# EAGLE design mMicroSD (EAGLE 6.2)
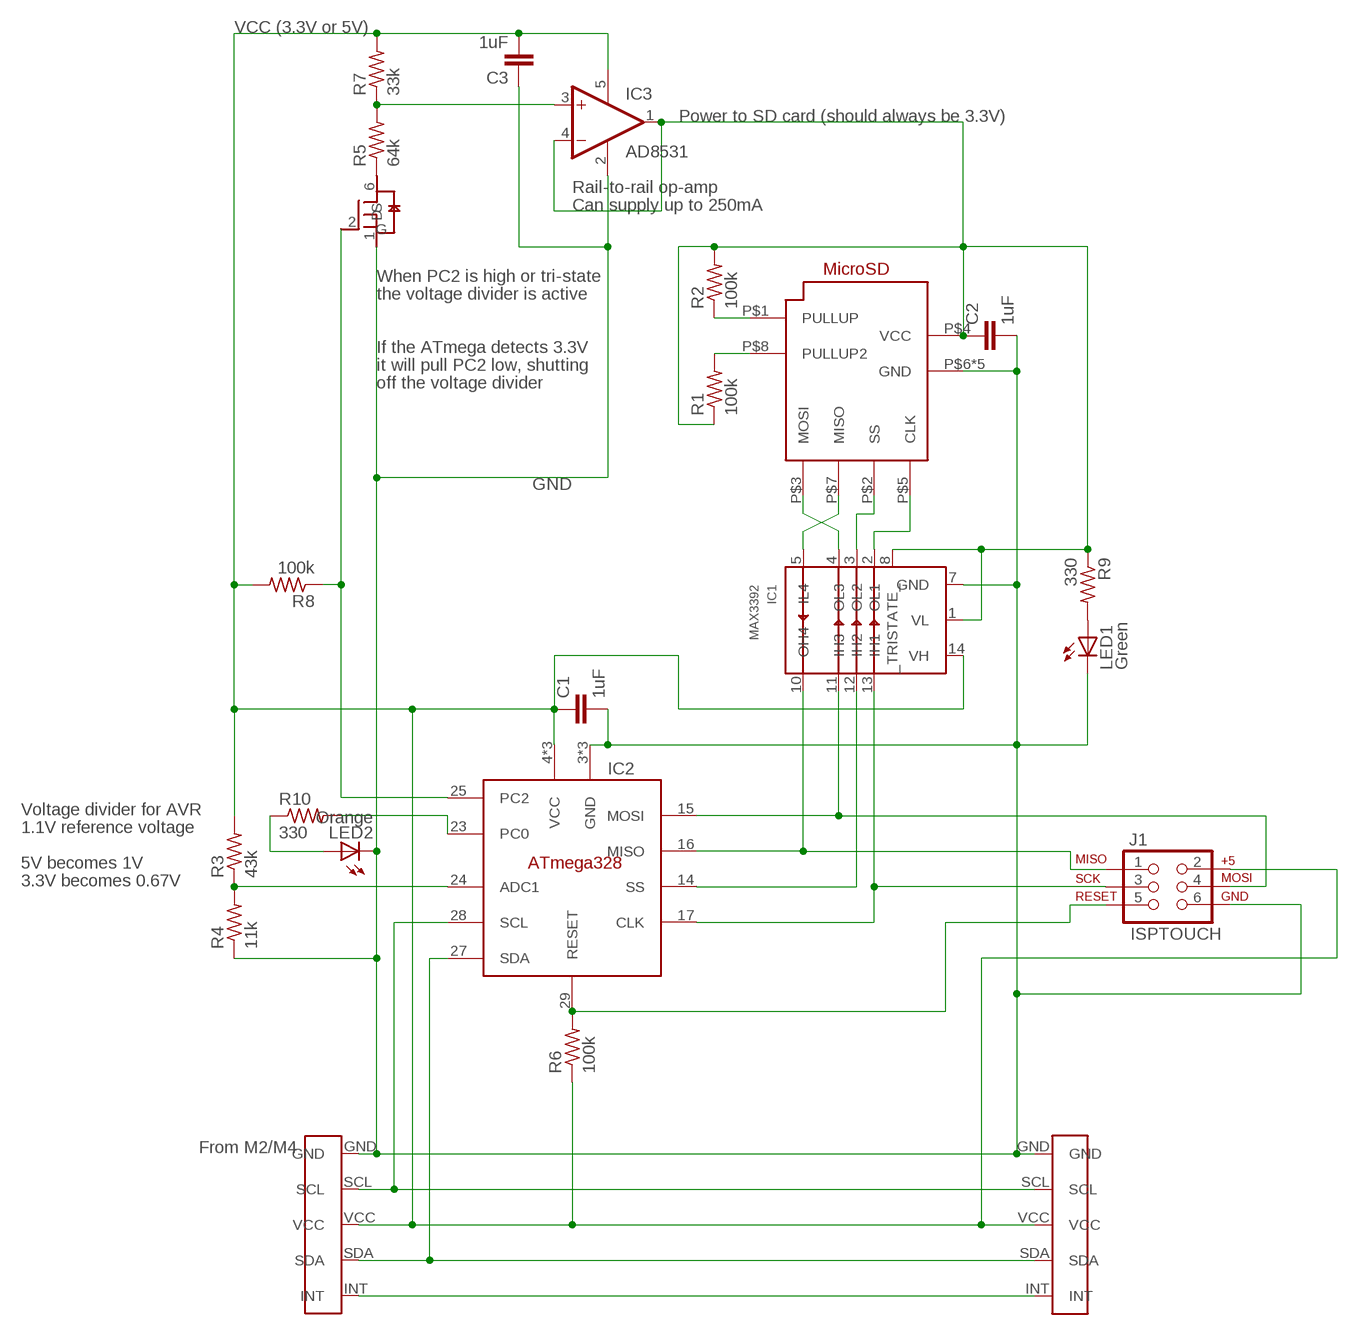
[diagram p0: schematic, sheet 1]

## Parts
C1  1uF  C-EUC0603  [C0603]
C2  1uF  C-EUC0603  [C0603]
C3  1uF  C-EUC0603  [C0603]
IC1  MAX3392  [14-TSSOP]
IC2  ATMEGA328  [ATMEGA328]
IC3  AD8531  [SOT-23-5]
J1  ISPTOUCH  ISPTOUCH_ADAPTER  [AVX_9188_6-WAY_SMT]
LED1  Green  LEDSML0603  [SML0603]
LED2  Orange  LEDSML0603  [SML0603]
M1  NTJD5121N  NTJD5121NT1G  [SOT-363]
R1  100k  R-US_R0603  [R0603]
R2  100k  R-US_R0603  [R0603]
R3  43k  R-US_R0603  [R0603]
R4  11k  R-US_R0603  [R0603]
R5  64k  R-US_R0603  [R0603]
R6  100k  R-US_R0603  [R0603]
R7  33k  R-US_R0603  [R0603]
R8  100k  R-US_R0603  [R0603]
R9  330  R-US_R0603  [R0603]
R10  330  R-US_R0603  [R0603]
SDCONN  101-00660-68-6  [101-00660-68-6]
U$1  MBUS_OUT  [MBUS_OUT]
U$2  MBUS_IN  [MBUS_IN]

## Nets
GND: C1.2 C2.2 C3.1 IC1.7(GND) IC2.3(GND) IC2.5(GND) IC2.21(GND) IC3.2(V-) J1.6 LED1.C LED2.C M1.1(S) R4.1 SDCONN.P$6(GND) SDCONN.P$9(GND) SDCONN.P$10(GND) SDCONN.P$11(GND) SDCONN.P$12(GND) U$1.GND U$2.GND
INT: U$1.INT U$2.INT
MISO: IC1.10(OH4) IC2.16(MISO) J1.1
MOSI: IC1.11(IH3) IC2.15(MOSI) J1.4
N$1: M1.6(D) R5.1
N$2: LED1.A R9.2
N$3: IC2.23(PC0) R10.2
N$4: LED2.A R10.1
N$5: IC1.5(IL4) SDCONN.P$7(MISO)
N$6: IC1.4(OL3) SDCONN.P$3(MOSI)
N$10: IC2.25(PC2) M1.2(G) R8.1
N$11: IC1.3(OL2) SDCONN.P$2(SS)
N$12: R1.2 SDCONN.P$8(PULLUP2)
N$13: R2.1 SDCONN.P$1(PULLUP)
N$15: IC1.2(OL1) SDCONN.P$5(CLK)
N$17: IC2.24(ADC1) R3.1 R4.2
OPAMP_VOLTAGE: IC3.3(+IN) R5.2 R7.1
RESET: IC2.29(RESET) J1.5 R6.2
SCK: IC1.13(IH1) IC2.17(CLK) J1.3
SCL: IC2.28(SCL) U$1.SCL U$2.SCL
SDA: IC2.27(SDA) U$1.SDA U$2.SDA
SS: IC1.12(IH2) IC2.14(SS)
VCC_MBUS: C1.1 C3.2 IC1.14(VH) IC2.4(VCC) IC2.6(VCC) IC2.18(VCC) IC3.5(V+) J1.2 R3.2 R6.1 R7.2 R8.2 U$1.VCC U$2.VCC
VCC_SD: C2.1 IC1.1(VL) IC1.8(_TRISTATE_) IC3.1(OUT) IC3.4(-IN) R1.1 R2.2 R9.1 SDCONN.P$4(VCC)
Unconnected: M1.3(D) M1.4(S) M1.5(G)

## Notes on the sheet
- VCC (3.3V or 5V)
- Power to SD card (should always be 3.3V)
- Rail-to-rail op-amp
- Can supply up to 250mA
- When PC2 is high or tri-state
- the voltage divider is active
- If the ATmega detects 3.3V
- it will pull PC2 low, shutting
- off the voltage divider
- Voltage divider for AVR
- 1.1V reference voltage
- 5V becomes 1V
- 3.3V becomes 0.67V
- From M2/M4

## Library data of the parts
C1-C3 = resistor:C-EU: CAPACITOR, European symbol
IC1 = haptics:MAX3392: 16Mbps level translator 3 high-to-low 1 low-to-high Min 1.2V Max 5.5V
IC2 = zz-kent:ATMEGA328
IC3 = haptics:AD8531: Rail-to-rail op amp, 2.7V to 6V supply difference, 250mA output
J1 = daspilker_ISPtouch:ISPTOUCH: ISPtouch for AVR Microcontrollers This 6-pin ISP connector for AVR programming does not require any part on the PCB, but an adapter for a common 6-pin programmer. http://daniel-spilker.com/blog/2011/04/25/isptouch-for-avr-microcontrollers/
LED1 LED2 = led:LED: LED OSRAM: - CHIPLED LG R971, LG N971, LY N971, LG Q971, LY Q971, LO R971, LY R971 LH N974, LH R974 LS Q976, LO Q976, LY Q976 LO Q996 - Hyper CHIPLED LW Q18S LB Q993, LB Q99A, LB R99A - SideLED LS A670, LO A670, LY A670, LG A670, LP A670 LB A673, LV A673, LT A673, LW A673 LH A674 LY A675 LS A676, LA A676, LO A676, LY A676, LW A676 LS A679, LY A679, LG A679 - Hyper Micro SIDELED® LS Y876, LA Y876, LO Y876, LY Y876 LT Y87S - SmartLED LW L88C, LW L88S LB L89C, LB L89S, LG L890 LS L89K, LO L89K, LY L89K LS L896, LA L896, LO L896, LY L896 - TOPLED LS T670, LO T670, LY T670, LG T670, LP T670 LSG T670, LSP T670, LSY T670, LOP T670, LYG T670 LG T671, LOG T671, LSG T671 LB T673, LV T673, LT T673, LW T673 LH T674 LS T676, LA T676, LO T676, LY T676, LB T676, LH T676, LSB T676, LW T676 LB T67C, LV T67C, LT T67C, LS T67K, LO T67K, LY T67K, LW E67C LS E67B, LA E67B, LO E67B, LY E67B, LB E67C, LV E67C, LT E67C LW T67C LS T679, LY T679, LG T679 LS T770, LO T770, LY T770, LG T770, LP T770 LB T773, LV T773, LT T773, LW T773 LH T774 LS E675, LA E675, LY E675, LS T675 LS T776, LA T776, LO T776, LY T776, LB T776 LHGB T686 LT T68C, LB T68C - Hyper Mini TOPLED® LB M676 - Mini TOPLED Santana® LG M470 LS M47K, LO M47K, LY M47K Source: http://www.osram.convergy.de LUXEON: - LUMILED® LXK2-PW12-R00, LXK2-PW12-S00, LXK2-PW14-U00, LXK2-PW14-V00 LXK2-PM12-R00, LXK2-PM12-S00, LXK2-PM14-U00 LXK2-PE12-Q00, LXK2-PE12-R00, LXK2-PE12-S00, LXK2-PE14-T00, LXK2-PE14-U00 LXK2-PB12-K00, LXK2-PB12-L00, LXK2-PB12-M00, LXK2-PB14-N00, LXK2-PB14-P00, LXK2-PB14-Q00 LXK2-PR12-L00, LXK2-PR12-M00, LXK2-PR14-Q00, LXK2-PR14-R00 LXK2-PD12-Q00, LXK2-PD12-R00, LXK2-PD12-S00 LXK2-PH12-R00, LXK2-PH12-S00 LXK2-PL12-P00, LXK2-PL12-Q00, LXK2-PL12-R00 Source: www.luxeon.com KINGBRIGHT: KA-3528ASYC Source: www.kingbright.com
M1 = haptics:NTJD5121NT1G: Dual 60V N-channel MOSFETs
R1-R10 = resistor:R-US_: RESISTOR, American symbol
SDCONN = zz-kent:101-00660-68-6: MicroSD connector
U$1 = zz-kent:MBUS_OUT
U$2 = zz-kent:MBUS_IN

## Board
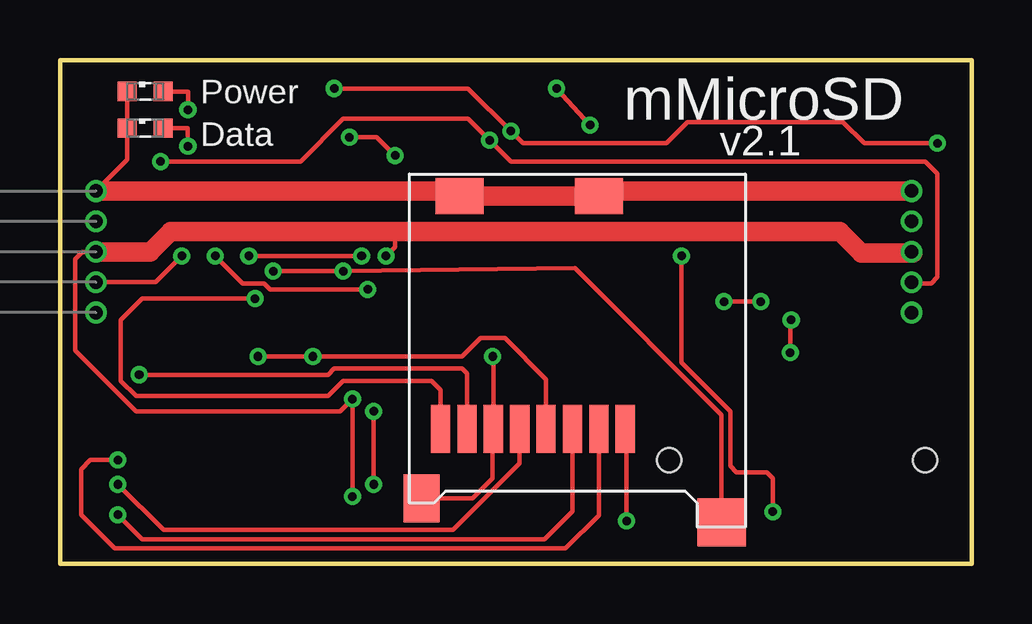
[diagram p1: board, top side]
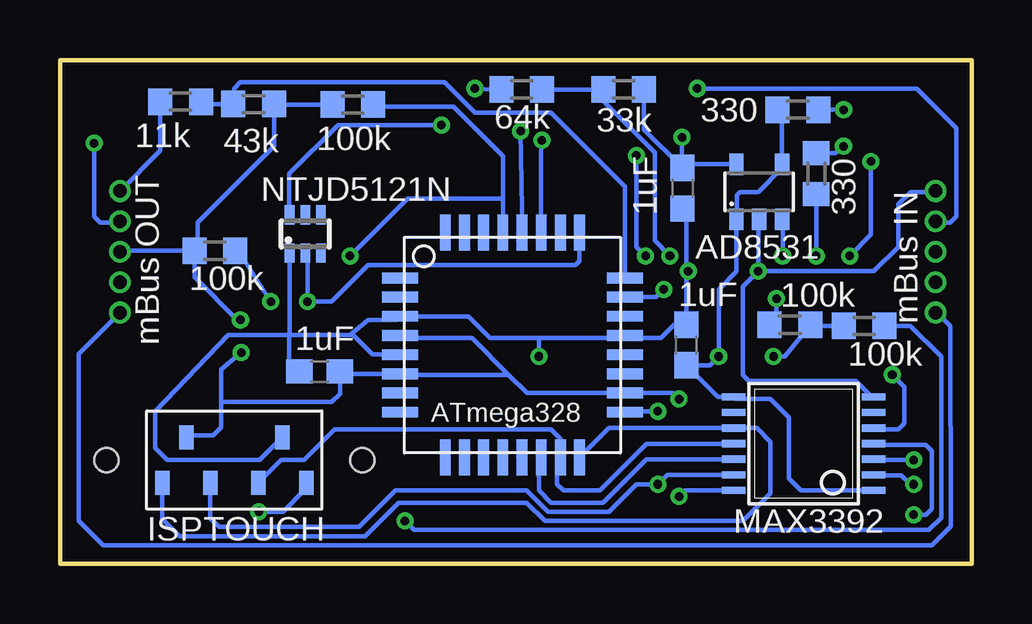
[diagram p2: board, bottom side, seen from below]

Size 38 x 21 mm. Coordinates in mm from the lower left corner, seen from the top.
Outline: 0,0 38,0 38,21 0,21 0,0
Copper layers (1*16): Top 0.0356mm / dielectric 1.5011mm / Bottom 0.0356mm
Design rules: minimum track width 6mil, minimum drill 13mil, track to track 6mil, track to pad 6mil, pad to pad 6mil, via to via 6mil, smd to smd 6mil, copper to edge 15mil, drill to drill 6mil, minimum pad ring 7mil, minimum via ring 7mil, stop-mask expansion 4mil, vias tented up to drill 0mil, thermal gap 10mil

### Footprints (pad centres in the part's own frame; a part is rotated, then mirrored left to right if it is on the bottom)
C0603 = smd 1.1 x 1: 1 -0.85,0; 2 0.85,0
14-TSSOP = smd 0.305 x 0.991: 1 -1.95,-2.918; 2 -1.3,-2.918; 3 -0.65,-2.918; 4 0,-2.918; 5 0.65,-2.918; 6 1.3,-2.918; 7 1.95,-2.918; 8 1.95,2.918; 9 1.3,2.918; 10 0.65,2.918; 11 0,2.918; 12 -0.65,2.918; 13 -1.3,2.918; 14 -1.95,2.918
ATMEGA328 = smd 1.5 x 0.45: 1 -4.572,2.91; 2 -4.572,2.11; 3 -4.572,1.31; 4 -4.572,0.51; 5 -4.572,-0.29; 6 -4.572,-1.09; 7 -4.572,-1.89; 8 -4.572,-2.69; 17 4.793,-2.69; 18 4.793,-1.89; 19 4.793,-1.09; 20 4.793,-0.29; 21 4.793,0.51; 22 4.793,1.31; 23 4.793,2.11; 24 4.793,2.91 | smd 0.45 x 1.5: 9 -2.69,-4.572; 10 -1.89,-4.572; 11 -1.09,-4.572; 12 -0.29,-4.572; 13 0.51,-4.572; 14 1.31,-4.572; 15 2.11,-4.572; 16 2.91,-4.572; 25 2.91,4.793; 26 2.11,4.793; 27 1.31,4.793; 28 0.51,4.793; 29 -0.29,4.793; 30 -1.09,4.793; 31 -1.89,4.793; 32 -2.69,4.793
SOT-23-5 = smd 0.6 x 0.9: 1 -0.95,-1.15; 2 0,-1.15; 3 0.95,-1.15; 4 0.95,1.15; 5 -0.95,1.15
AVX_9188_6-WAY_SMT = smd 0.6 x 1: 1 -3,-0.95; 2 -2,0.95; 3 -1,-0.95; 4 1,-0.95; 5 3,-0.95; 6 2,0.95 | hole 1: -5.334,0; 5.334,0
SML0603 = smd 0.8 x 0.8: A 0.75,0; C -0.75,0
SOT-363 = smd 0.4 x 0.8: 1 -0.65,-0.8; 2 0,-0.8; 3 0.65,-0.8; 4 0.65,0.8; 5 0,0.8; 6 -0.65,0.8
R0603 = smd 1 x 1.1: 1 -0.85,0; 2 0.85,0
101-00660-68-6 = smd 2 x 0.8: P$1 4.9,1; P$2 4.9,-0.1; P$3 4.9,-1.2; P$4 4.9,-2.3; P$5 4.9,-3.4; P$6 4.9,-4.5; P$7 4.9,-5.6; P$8 4.9,-6.7 | smd 1.5 x 2: P$9 -4.8,-0.1; P$10 -4.8,-5.9 | smd 2 x 1.5: P$11 7.8,-7.5 | smd 2 x 2.008: P$12 8.8,5.018
MBUS_OUT = drill 0.559 pad 0.762: GND 0,2.54; INT 0,-2.54; SCL 0,1.27; SDA 0,-1.27; VCC 0,0
MBUS_IN = drill 0.559 pad 0.762: GND 0,2.54; INT 0,-2.54; SCL 0,1.27; SDA 0,-1.27; VCC 0,0

### Placement (x,y rotation side)
C1  12.05,15.65 270 bottom
C2  11.89,9.11 90 bottom
C3  27.18,8 0 bottom
IC1  7,5 90 bottom
IC2  19.25,9 0 bottom
IC3  8.85,15.5 0 bottom
J1  30.73,4.32 0 bottom
LED1  3.56,19.68 0 top
LED2  3.56,18.16 0 top
M1  27.78,13.74 0 bottom
R1  7.57,9.96 180 bottom
R2  4.48,9.91 180 bottom
R3  29.93,19.16 0 bottom
R4  32.97,19.25 0 bottom
R5  18.75,19.77 0 bottom
R6  25.79,19.14 0 bottom
R7  14.5,19.77 0 bottom
R8  31.54,13.04 180 bottom
R9  7.24,18.92 0 bottom
R10  6.48,16.26 270 bottom
SDCONN  22.56,10.52 270 top
U$1  35.5,13 0 top
U$2  1.5,13 0 top

### Tracks (layer width: path | path; a pad name or v marks a point on that pad's centre or on a via)
GND  (via drill 0.36)
  Top 0.178: v8.89,12.19 v11.81,12.19 21.46,12.32 27.58,6.2 SDCONN.P$12 | SDCONN.P$11 17.19,2.72 18.03,3.56 18.03,5.59 SDCONN.P$6 18.06,8.61 v18.03,8.64 | LED1.C LED2.C 2.81,16.85 U$2.GND | 16.76,15.24 16.74,15.24 SDCONN.P$10
  Top 0.406: 16.38,15.49 16.76,15.24 | 22.69,15.54 SDCONN.P$9
  Top 0.813: SDCONN.P$9 SDCONN.P$10 16.44,15.54 U$2.GND | U$1.GND 22.69,15.54
  Bottom 0.178: IC2.5 24.97,8.71 25.78,9.53 25.91,9.53 | 28.45,9.53 30.99,9.53 34.04,6.35 34.04,4.83 33.53,4.32 29.68,4.32 J1.6 | 18.03,9.4 20.07,9.4 20.98,10.31 IC2.3 23.97,10.16 25.15,10.16 25.91,9.53 | 18.03,9.4 14.57,9.4 IC2.21 14.35,9.4 12.95,9.4 12.39,9.96 C2.2 11.89,12.19 | 11.89,12.19 11.89,14.65 C1.2 | M1.1 28.43,9.55 28.45,9.53 | R4.1 33.82,17.22 U$1.GND | v8.89,12.19 4.06,12.19 3.05,13.21 3.05,14.99 2.54,15.49 1.55,15.49 U$2.GND | v18.03,8.64 18.03,9.4 | IC1.7 4.16,6.95 4.83,7.62 9.27,7.62 9.53,7.87 9.53,11.56 v8.89,12.19 | v11.81,12.19 11.89,12.19 | v8.89,12.19 8.89,14.31 IC3.2 | 28.45,9.53 25.91,9.53 | 28.45,9.53 28.45,8.42 C3.1
INT
  Bottom 0.178: U$2.INT 1.44,10.46 0.89,9.91 0.86,1.55 1.65,0.76 36.2,0.76 37.21,1.78 37.21,8.75 U$1.INT
MISO
  Bottom 0.178: IC2.16 15.12,5.65 IC1.10 8.95,5.65 8.38,5.08 8.38,2.92 9.53,1.78 17.78,1.78 18.54,2.54 23.88,2.54 25.27,1.14 33.02,1.14 33.73,1.86 J1.1
MOSI
  Bottom 0.178: IC1.11 13.54,5 15.49,3.05 17.02,3.05 17.27,3.3 17.27,4.29 IC2.15 17.14,5.2 17.53,5.59 26.54,5.59 27.81,4.32 28.78,4.32 J1.4
N$1  (via drill 0.36)
  Top 0.178: v20.7,19.81 v22.1,18.29
  Bottom 0.178: R5.1 19.9,19.77 v20.7,19.81 | v22.1,18.29 26.42,18.29 28.45,16.26 28.45,14.57 M1.6
N$2  (via drill 0.36)
  Top 0.178: v5.33,18.92 5.33,19.68 LED1.A
  Bottom 0.178: R9.2 v5.33,18.92
N$3  (via drill 0.36)
  Top 0.178: v6.48,12.83 7.62,11.68 8.51,11.68 8.76,11.43 v12.83,11.43
  Bottom 0.178: IC2.23 13.15,11.11 v12.83,11.43 | v6.48,12.83 R10.2
N$4  (via drill 0.36)
  Top 0.178: v5.33,17.4 5.32,18.16 LED2.A
  Bottom 0.178: R10.1 5.68,17.11 v5.33,17.4
N$5  (via drill 0.36)
  Top 0.178: SDCONN.P$7 16.96,7.93 16.76,8.13 11.43,8.13 11.18,7.87 v3.3,7.87
  Bottom 0.178: v3.3,7.87 2.79,7.37 2.79,5.84 3.05,5.59 3.89,5.59 IC1.5
N$6  (via drill 0.36)
  Top 0.178: SDCONN.P$3 21.36,2.19 20.19,1.02 3.43,1.02 v2.41,2.03
  Bottom 0.178: v2.41,2.03 1.91,2.03 1.65,2.29 1.65,4.7 1.91,4.95 4.04,4.95 IC1.4
N$10  (via drill 0.36)
  Top 0.178: v29.21,10.92 v27.69,10.92
  Bottom 0.178: R8.1 30.57,13.04 v29.21,10.92 | M1.2 27.69,12.85 v27.69,10.92 26.67,10.92 25.15,12.45 16.51,12.45 16.34,12.62 IC2.25
N$11  (via drill 0.36)
  Top 0.178: SDCONN.P$2 22.46,2.02 21.08,0.64 2.29,0.64 0.89,2.03 0.89,3.94 1.27,4.32 v2.41,4.32
  Bottom 0.178: v2.41,4.32 4.05,4.32 IC1.3
N$12  (via drill 0.36)
  Top 0.178: SDCONN.P$8 15.86,7.25 15.49,7.62 11.81,7.62 11.18,6.99 3.17,6.99 2.54,7.62 2.54,10.16 3.43,11.05 v8.13,11.05
  Bottom 0.178: v8.13,11.05 8.13,10.13 R1.2
N$13  (via drill 0.36)
  Top 0.178: v23.62,1.78 23.62,5.56 SDCONN.P$1
  Bottom 0.178: R2.1 2.54,9.91 1.27,8.64 1.27,1.91 1.78,1.4 23.24,1.4 v23.62,1.78
N$15  (via drill 0.36)
  Top 0.178: SDCONN.P$5 19.16,4.18 16.38,1.4 4.32,1.4 v2.41,3.3
  Bottom 0.178: v2.41,3.3 2.54,3.3 2.92,3.68 4.07,3.68 IC1.2
N$17
  Bottom 0.178: R4.2 32.04,19.16 R3.1 30.73,19.21 30.73,19.81 30.48,20.07 21.97,20.07 20.7,18.8 17.53,18.8 14.46,15.73 IC2.24
OPAMP_VOLTAGE  (via drill 0.36)
  Top 0.178: v12.57,12.83 v7.87,12.83
  Bottom 0.178: R5.2 R7.1 | R7.1 | R7.1 15.35,19.29 13.21,17.14 13.21,13.46 v12.57,12.83 | v7.87,12.83 7.87,14.32 IC3.3
RESET  (via drill 0.36)
  Top 0.178: v25.91,12.83 25.91,8.38 27.94,6.35 27.94,4.06 28.19,3.81 29.46,3.81 29.72,3.56 v29.72,2.16
  Bottom 0.178: IC2.29 19.54,15.23 | 19.54,15.23 19.54,17 21.59,19.05 24.86,19.05 R6.2 | 19.54,15.23 23.51,15.23 v25.91,12.83 | J1.5 27.8,3.43 27.8,3.07 28.7,2.16 v29.72,2.16
SCK  (via drill 0.36)
  Top 0.178: v13.08,3.3 v13.08,6.35
  Bottom 0.178: IC1.13 12.68,3.7 v13.08,3.3 13.97,3.3 15.11,2.16 17.65,2.16 18.54,3.05 24,3.05 25.53,1.52 31.37,1.52 31.73,1.89 J1.3 | v13.08,6.35 14.42,6.35 IC2.17
SCL  (via drill 0.36)
  Top 0.178: v11.43,19.81 17.02,19.81 v18.8,18.03 19.3,17.53 25.27,17.53 26.16,18.41 32.64,18.41 33.53,17.53 v36.58,17.53
  Bottom 0.178: IC2.28 18.74,14.79 v18.8,18.03 | v11.43,19.81 2.29,19.81 0.64,18.16 0.64,14.48 0.89,14.22 1.45,14.22 U$2.SCL | v36.58,17.53 36.58,14.48 36.32,14.22 35.55,14.22 U$1.SCL
SDA  (via drill 0.36)
  Top 0.178: v4.19,16.76 10.03,16.76 11.81,18.54 17.02,18.54 v17.91,17.65 18.8,16.76 36.07,16.76 36.58,16.26 36.58,11.94 36.32,11.68 35.55,11.68 U$1.SDA | U$2.SDA 3.98,11.73 v5.08,12.83
  Bottom 0.178: IC2.27 17.94,17.11 v17.91,17.65 | v5.08,12.83 4.19,13.72 v4.19,16.76
SS
  Bottom 0.178: IC1.12 13.56,4.35 15.37,2.54 17.53,2.54 18.03,3.05 18.03,4.33 IC2.14
VCC_MBUS  (via drill 0.36)
  Top 0.178: v12.19,2.79 v12.19,6.86 11.68,6.35 3.17,6.35 0.64,8.89 0.64,12.7 0.94,13 U$2.VCC | v30.44,8.8 30.44,10.07 v30.48,10.16 | v12.06,17.78 13.21,17.78 v13.97,17.02 | v13.59,12.83 13.97,13.21 13.97,13.84
  Top 0.813: 35.56,12.95 33.4,12.95 32.51,13.84 13.97,13.84 4.61,13.84 3.76,13 U$2.VCC
  Bottom 0.178: IC1.14 11.94,3.05 v12.19,2.79 | v12.19,6.86 12.45,7.11 IC2.18 18.54,7.11 19.3,7.87 | 19.3,7.87 23.79,7.87 IC2.6 26.24,7.91 C3.2 26.33,7.07 26.67,6.73 31.27,6.73 | 19.3,7.87 20.83,9.4 23.71,9.4 IC2.4 | R6.1 29.05,19.14 R3.2 29.08,17.41 32.26,14.22 32.26,13.18 R8.2 | C1.1 11.91,16.65 IC3.5 | R7.2 13.65,18.1 C1.1 | v30.48,10.16 30.61,10.16 32.38,11.94 R8.2 | R8.2 35.46,13.04 U$1.VCC | 31.27,6.73 31.27,8.1 v30.44,8.8 | 31.27,6.73 31.27,5.69 31.62,5.33 32.67,5.33 J1.2 | v12.06,17.78 12.06,16.52 C1.1 | v13.97,17.02 13.97,13.21 v13.59,12.83
VCC_SD  (via drill 0.36)
  Top 0.178: SDCONN.P$4 20.26,7.68 18.54,9.4 17.53,9.4 16.76,8.64 10.41,8.64 | 10.41,8.64 v8.26,8.64 | v10.54,8.64 10.54,8.76 10.41,8.64
  Bottom 0.178: IC1.1 7.11,3.05 7.62,3.56 7.62,6.1 8.38,6.86 9.83,6.86 IC1.8 10.58,6.95 C2.1 10.91,8.26 v10.54,8.64 10.54,11.43 9.8,12.17 IC3.1 9.78,14.37 9.78,15.37 9.65,15.49 8.89,15.49 7.9,16.48 IC3.4 7.9,18.74 R9.1 | R2.2 6.55,9.91 R1.1 7.79,8.64 v8.26,8.64

### Text on the board
tPlace: Power | mMicroSD | Data | v2.1
bPlace: mBus IN | mBus OUT